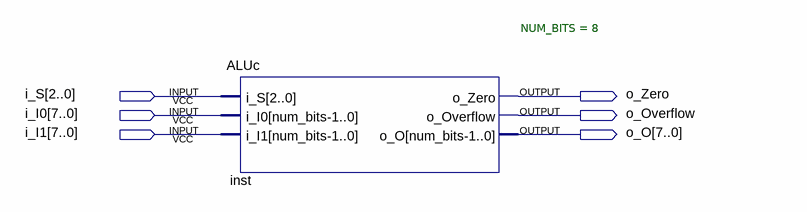
[diagram p0: schematic sheet]
// Quartus schematic ALU_test.bdf as structural Verilog: 1 symbols, 6 pins
module ALU_test (
  input  [2:0] i_S,
  input  [7:0] i_I0,
  input  [7:0] i_I1,
  output o_Zero,
  output o_Overflow,
  output [7:0] o_O
);

  ALUc #(.NUM_BITS(8)) inst (.i_S(i_S), .i_I0(i_I0), .i_I1(i_I1), .o_Zero(o_Zero), .o_Overflow(o_Overflow), .o_O(o_O));
endmodule
